# EasyEDA Pro project ProPrj_GraEsp(2)_2026-05-25.epro

# Schematic Schematic1
Board Name: Board1; Create Date: 2026-05-18; Page Name: P1; Project Name: GraEsp; Schematic Name: Schematic1; Update Date: 2026-05-18; Company: 嘉立创EDA; Page Size: A4; Version: V1.0
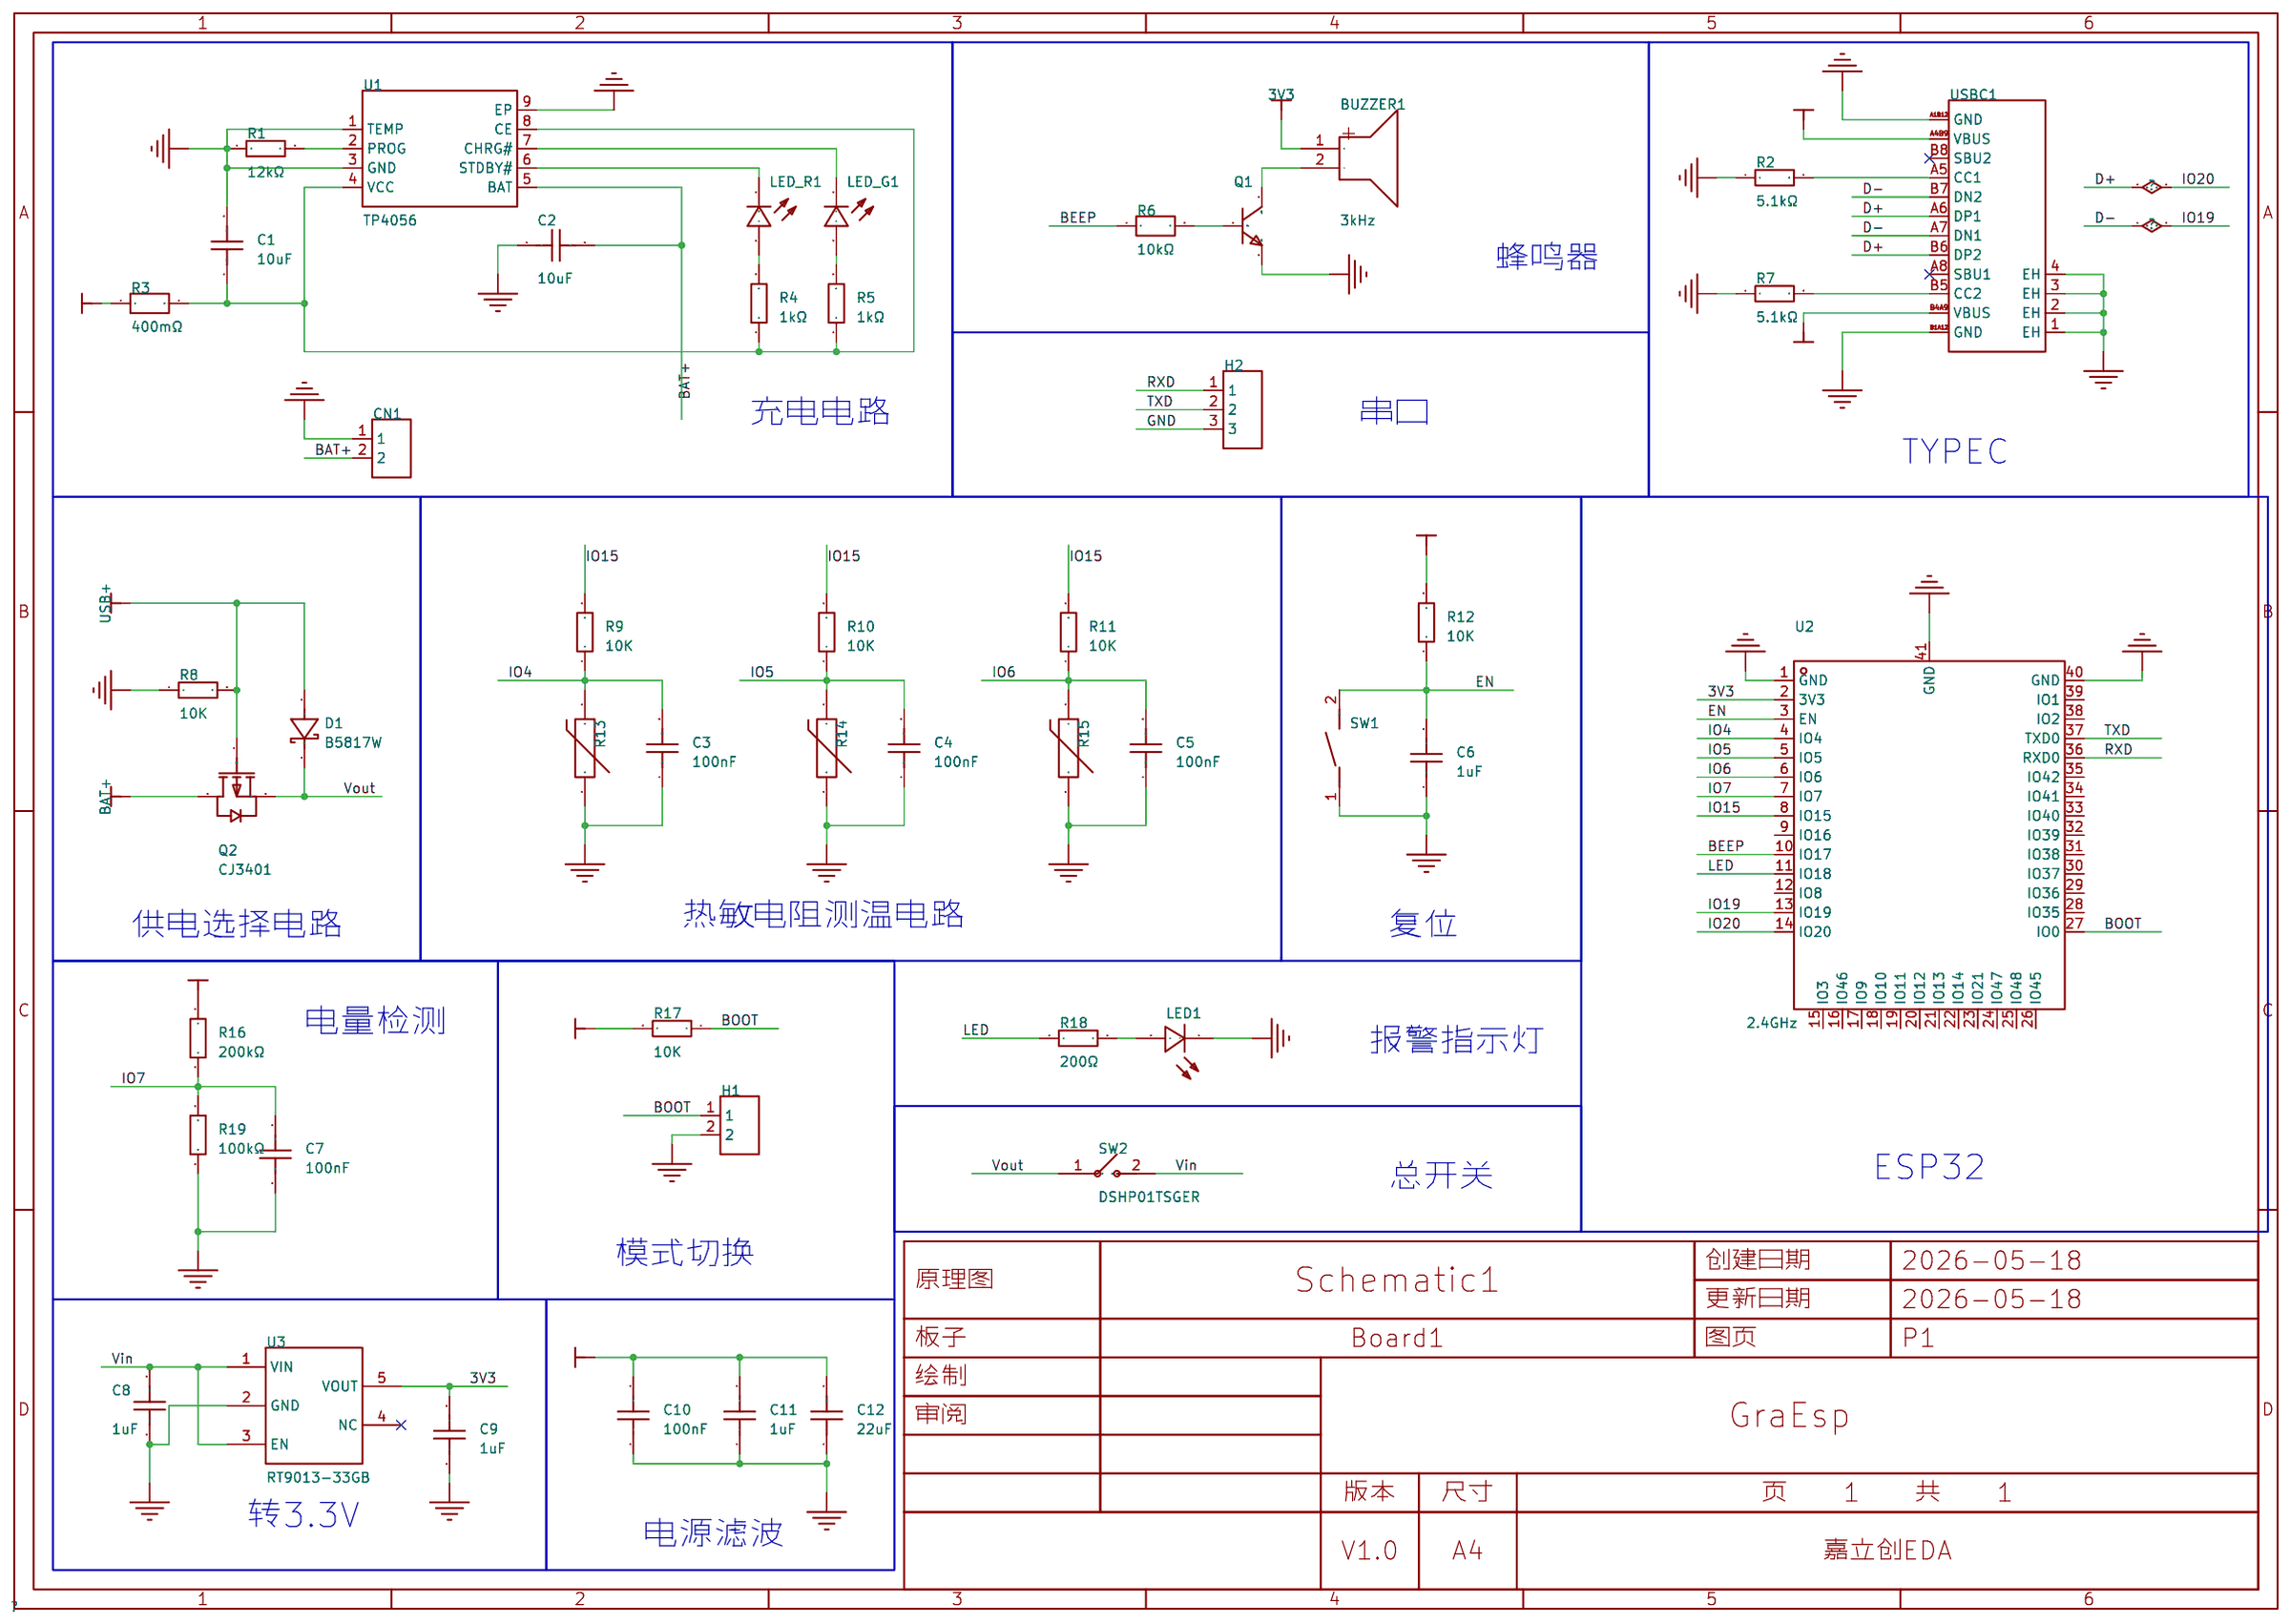
[diagram p0: schematic sheet]

## Parts
BUZZER1  3kHz  [BUZ-TH_BD9.0-P5.00-D0.6-FD]
C1  10uF  [C0603]
C2  10uF  [C0603]
C3  100nF  [C0603]
C4  100nF  [C0603]
C5  100nF  [C0603]
C6  1uF  [C0603]
C7  100nF  [C0603]
C8  1uF  [C0603]
C9  1uF  [C0603]
C10  100nF  [C0603]
C11  1uF  [C0603]
C12  22uF  [C0603]
CN1  ZX-XH2.54-2PZZ  [CONN-TH_2P-P2.50_HX25003-2A]
D1  B5817W  [SOD-123_L2.7-W1.6-LS3.7-FD]
H1  PZ254V-11-02P  [HDR-TH_2P-P2.54-V-M]
H2  PZ254V-11-03P  [HDR-TH_3P-P2.54-V-M_PZ254V-11-03P]
LED1  LTST-C190YKT  [LED0603-RD]
LED_G1  NCD0603G1  [LED0603-RD_1]
LED_R1  NCD0603R1  [LED0603-RD_RED]
Q1  MMBT3904 1AM  [SOT-23-3_L2.9-W1.3-P0.95-LS2.4-BR]
Q2  CJ3401  [SOT-23-3_L2.9-W1.6-P1.90-LS2.8-BR]
R1  12kΩ  [R0603]
R2  5.1kΩ  [R0603]
R3  400mΩ  [R0603]
R4  1kΩ  [R0603]
R5  1kΩ  [R0603]
R6  10kΩ  [R0603]
R7  5.1kΩ  [R0603]
R8  10K  [R0603]
R9  10K  [R0603]
R10  10K  [R0603]
R11  10K  [R0603]
R12  10K  [R0603]
R13  MF52A103F3435 (A1)  [RES-TH_L2.5-W2.5-P1.70-D0.3]
R14  MF52A103F3435 (A1)  [RES-TH_L2.5-W2.5-P1.70-D0.3]
R15  MF52A103F3435 (A1)  [RES-TH_L2.5-W2.5-P1.70-D0.3]
R16  200kΩ  [R0603]
R17  10K  [R0603]
R18  200Ω  [R0603]
R19  100kΩ  [R0603]
SW1  TS-1088-AR02016  [SW-SMD_L3.9-W3.0-P4.45]
SW2  DSHP01TSGER  [SW-SMD_DSHP01TSGER]
U1  TP4056  [ESOP-8_L4.9-W3.9-P1.27-LS6.0-BL-EP]
U2  2.4GHz  [WIRELM-SMD_ESP32-S3-WROOM-1]
U3  RT9013-33GB  [SOT-23-5_L3.0-W1.7-P0.95-LS2.8-BL]
USBC1  TYPE-C-31-M-12  [USB-C_SMD-TYPE-C-31-M-12_1]

## Library data of the parts
BUZZER1 = HNB09A03: 驱动方式:有源(内含驱动线路);构造类型:电磁式;频率:3kHz;声压(SPL):85dB;; LCSC Part Name: 电磁式有源一体蜂鸣器HNB09A03; Supplier Part: C96102; Manufacturer: 华能; Supplier Footprint: 插件,D=9mm; JLCPCB Part Class: 扩展库; Datasheet: https://atta.szlcsc.com/upload/public/pdf/source/20241128/61C4C8C3938BB25F7C38FBE94CCE8DCF.pdf; Supplier: LCSC; Driver Circuitry: 有源(内含驱动线路); Technology: 电磁式; Voltage - Supply: 1.5V~4.5V; Current Consumption: 30mA; Sound Pressure Level(SPL): 85dB; Diameter(φD): 9mm; Height: 5.5mm; Operating Temperature: -20℃~+70℃
C1 C2 = CGA0603X5R106K100JT: 容值:10uF;精度:±10%;额定电压:10V;温度系数:X5R;; LCSC Part Name: 10uF ±10% 10V; Supplier Part: C6119842; Manufacturer: HRE(芯声); Supplier Footprint: 0603; JLCPCB Part Class: Extended Part; Supplier: LCSC; Tolerance: ±10%; Voltage Rating: 10V; Temperature Coefficient: X5R
C3-C5 C7 C10 = CGA0603X7R104K500JT: 容值:100nF;精度:±10%;额定电压:50V;温度系数:X7R;; LCSC Part Name: 100nF ±10% 50V; Supplier Part: C6119867; Manufacturer: HRE(芯声); Supplier Footprint: 0603; JLCPCB Part Class: Extended Part; Datasheet: https://atta.szlcsc.com/upload/public/pdf/source/20250103/C44077DA9E7B3EFAE02F22B6D3D1CBC9.pdf; Supplier: LCSC; Tolerance: ±10%; Voltage Rating: 50V; Temperature Coefficient: X7R
C6 C8 C9 = CGA0603X5R105K500JT: 容值:1uF;精度:±10%;额定电压:50V;温度系数:X5R;; LCSC Part Name: 1uF ±10% 50V; Supplier Part: C6119852; Manufacturer: HRE(芯声); Supplier Footprint: 0603; JLCPCB Part Class: 扩展库; Supplier: LCSC; Tolerance: ±10%; Voltage Rating: 50V; Temperature Coefficient: X5R
C11 = CGA0603X5R105K500JT: 容值:1uF;精度:±10%;额定电压:50V;温度系数:X5R;; LCSC Part Name: 1uF ±10% 50V; Supplier Part: C6119852; Manufacturer: HRE(芯声); Supplier Footprint: 0603; JLCPCB Part Class: 扩展库; Datasheet: https://item.szlcsc.com/datasheet/CGA0603X5R105K500JT/7062558.html; Supplier: LCSC; Tolerance: ±10%; Voltage Rating: 50V; Temperature Coefficient: X5R
C12 = CGA0603X5R226M160JT: 容值:22uF;精度:±20%;额定电压:16V;温度系数:X5R;; LCSC Part Name: 22uF ±20% 16V; Supplier Part: C6119868; Manufacturer: HRE(芯声); Supplier Footprint: 0603; JLCPCB Part Class: 扩展库; Datasheet: https://item.szlcsc.com/datasheet/CGA0603X5R226M160JT/7062574.html; Supplier: LCSC; Tolerance: ±20%; Voltage Rating: 16V; Temperature Coefficient: X5R
CN1 = ZX-XH2.54-2PZZ: 插针结构:1x2P;间距:2.5mm;安装方式:直插;参考系列:XH;总PIN数:2P;排数:1;每排PIN数:2;行距:-;额定电流:3A;触头材质:黄铜;触头镀层:锡;工作温度范围:-25℃~+85℃;; LCSC Part Name: 1x2P 间距:2.5mm 直插 系列:XH; Supplier Part: C7429632; Manufacturer: Megastar(兆星); Supplier Footprint: 插件,P=2.5mm; JLCPCB Part Class: Extended Part; Datasheet: https://atta.szlcsc.com/upload/public/pdf/source/20230619/19BA6947230AA44A04D3EDD65E618FD0.pdf; Supplier: LCSC; Pins Structure: 1x2P; Pitch: 2.5mm; Mounting Type: 直插; Reference Series: XH; Number of Pins: 2P; Number of Rows: 1; Number of PINs Per Row: 2; Rated Current: 3A; Contact Material: 黄铜; Contact Plating: 锡; Operating Temperature: -25℃~+85℃; Rated Voltage (Max): 250V; Plastic Material: PA66; Flame Retardant Rating: UL94V-0; Color: 白色; Z-Height of the Board: 7mm; X-Length of Bottom Edge on Board (Spacing Line): 7.5mm; Y-Width of Bottom Edge on Board: 5.9mm
D1 = B5817W_C7420328: 二极管配置:独立式;正向压降(Vf):450mV@1.0A;直流反向耐压(Vr):20V;整流电流:1A;; LCSC Part Name: 电压:20V 电流:1A; Supplier Part: C7420328; Manufacturer: 宏迦橙; Supplier Footprint: SOD-123; JLCPCB Part Class: 扩展库; Datasheet: https://atta.szlcsc.com/upload/public/pdf/source/20230828/EE0D571642CD3E42C48F1182066654A1.pdf; Supplier: LCSC; Diode Configuration: 独立式; Forward Voltage (Vf@If): 450mV@1.0A; Reverse Voltage (Vr): 20V; Rectified Current: 1A; Reverse Leakage Current (Ir): 1mA@20V
H1 = PZ254V-11-02P: 插针结构:1x2P;间距:2.54mm;行距:-;圆针/方针:方针;安装方式:直插;排数:单排;总PIN位数:2P;额定电流:3A;额定电压:250V;配合针长度:6mm;塑高:2.5mm;端接针长度:3mm;触头材质:黄铜;触头镀层:-;工作温度:-40℃~+105℃;颜色:黑色;; LCSC Part Name: 1x2P 间距:2.54mm 方针 直插; Supplier Part: C492401; Manufacturer: XFCN(兴飞); Supplier Footprint: 插件,P=2.54mm; JLCPCB Part Class: Extended Part; Datasheet: https://item.szlcsc.com/datasheet/PZ254V-11-02P/502957.html; Supplier: LCSC; Pin Structure: 1x2P; Pitch: 2.54mm; Circluar Pins/Square Pins: 方针; Mounting Type: 直插; Number of Rows: 单排; Number of Pins: 2P; Current Rating: 3A; Voltage Rating (Max): 250V; Length of Mating Pin: 6mm; Insulation Height: 2.5mm; Length of End Connection Pin: 3mm; Contact Material: 黄铜; Operating Temperature: -40℃~+105℃; Color: 黑色
H2 = PZ254V-11-03P: 插针结构:1x3P;间距:2.54mm;行距:-;圆针/方针:方针;安装方式:直插;排数:单排;总PIN位数:3P;额定电流:3A;额定电压:250V;配合针长度:6mm;塑高:2.5mm;端接针长度:3mm;工作温度:-40℃~+105℃;颜色:黑色;; LCSC Part Name: 1x3P 间距:2.54mm 方针 直插; Supplier Part: C2937625; Manufacturer: XFCN(兴飞); Supplier Footprint: 插件,P=2.54mm; JLCPCB Part Class: Extended Part; Datasheet: https://item.szlcsc.com/datasheet/PZ254V-11-03P/3293280.html; Supplier: LCSC; Pin Structure: 1x3P; Pitch: 2.54mm; Circluar Pins/Square Pins: 方针; Mounting Type: 直插; Number of Rows: 单排; Number of Pins: 3P; Current Rating: 3A; Voltage Rating (Max): 250V; Length of Mating Pin: 6mm; Insulation Height: 2.5mm; Length of End Connection Pin: 3mm; Operating Temperature: -40℃~+105℃; Color: 黑色
LED1 = LTST-C190YKT: 发光颜色:黄色;正向电压(VF):2.1V;功率:60mW;正向电流:20mA;主波长:588nm;二极管配置:-;透镜颜色:无色透明透镜;色温:-;发光强度:6mcd;发光角度:130°;载带方式:-;工作温度:-55℃~+85℃;; LCSC Part Name: 黄灯; Supplier Part: C125097; Manufacturer: LITEON(光宝); Supplier Footprint: 0603; JLCPCB Part Class: 扩展库; Datasheet: https://atta.szlcsc.com/upload/public/pdf/source/20180326/C125097_8A610ECE31461EDC7D081EA09A856E73.pdf; Supplier: LCSC; Emitted Color: 黄色; Forward Voltage (VF): 2.1V; Power Dissipation: 60mW; Forward Current: 20mA; Dominant Wavelength: 588nm; Peak Wavelength: 585nm; Lens Color: 无色透明透镜; Luminous Intensity: 6mcd; Viewing Angle: 130°; Operating Temperature: -55℃~+85℃
LED_G1 = NCD0603G1: 发光颜色:翠绿色;正向压降(Vf):2.6V~3.6V;功率:72mW;正向电流:20mA;波长:515nm~530nm;透镜颜色:-;发光强度:330mcd~900mcd;发光角度:130°;工作温度:-30℃~+85℃;; Supplier Part: C84267; Manufacturer: 国星光电; Supplier Footprint: 0603; JLCPCB Part Class: Extended Part; Datasheet: https://atta.szlcsc.com/upload/public/pdf/source/20200820/C84267_04BA7703640BAC111D09F5EFB971FBF3.pdf; Supplier: LCSC; Illumination Color: 翠绿色; Voltage - Forward(Vf): 2.6V~3.6V; Power(Watts): 72mW; Forward Current: 20mA; Wavelength - Dominant: 515nm~530nm; Luminous Intensity: 330mcd~900mcd; Viewing Angle: 130°; Operating Temperature: -30℃~+85℃
LED_R1 = NCD0603R1_C84263: 灯头类型:-;发光颜色:红色;正向压降(Vf):1.6V~2.6V;功率:65mW;正向电流:25mA;波长:615nm~630nm;二极管配置:独立二极管;透镜颜色:-;色温:-;发光强度:80mcd~220mcd;发光角度:130°;载带方式:-;工作温度:-30℃~+85℃;; Supplier Part: C84263; Manufacturer: 国星光电; Supplier Footprint: 0603; JLCPCB Part Class: Extended Part; Datasheet: https://atta.szlcsc.com/upload/public/pdf/source/20200820/C84263_DABC6A75E58F576973B407FDBA283D60.pdf; Supplier: LCSC; Illumination Color: 红色; Voltage - Forward(Vf): 1.6V~2.6V; Power(Watts): 65mW; Forward Current: 25mA; Wavelength - Dominant: 615nm~630nm; Diode Configuration: 独立二极管; Luminous Intensity: 80mcd~220mcd; Viewing Angle: 130°; Operating Temperature: -30℃~+85℃
Q1 = MMBT3904 1AM: 晶体管类型:NPN;集电极电流(Ic):200mA;集射极击穿电压(Vceo):40V;耗散功率(Pd):200mW;直流电流增益(hFE):300@10mA,1V;; Supplier Part: C2985655; Manufacturer: YONGYUTAI(永裕泰); Supplier Footprint: SOT-23; JLCPCB Part Class: 扩展库; Datasheet: https://atta.szlcsc.com/upload/public/pdf/source/20220328/E5F75A35095E467F40664A08ADD2DE31.pdf; Supplier: LCSC; type: NPN; Current - Collector(Ic): 200mA; Collector - Emitter Voltage VCEO: 40V; Pd - Power Dissipation: 200mW; DC Current Gain: 300@10mA,1V; Transition frequency(fT): 300MHz; Current - Collector Cutoff: 100nA; Vce Saturation(VCE(sat)): 300mV
Q2 = CJ3401: 类型:1个P沟道;漏源电压(Vdss):30V;连续漏极电流(Id):4.2A;导通电阻(RDS(on)):75mΩ@4.5V,4A;耗散功率(Pd):350mW;阈值电压(Vgs(th)):1.3V;; LCSC Part Name: 1个P沟道 耐压:30V 电流:4.2A; Supplier Part: C13799; Manufacturer: CJ(江苏长电/长晶); Supplier Footprint: SOT-23; JLCPCB Part Class: 扩展库; Datasheet: https://atta.szlcsc.com/upload/public/pdf/source/20140815/1457707217656.pdf; Supplier: LCSC; Type: 1个P沟道; Drain to Source Voltage: 30V; Current - Continuous Drain(Id): 4.2A; RDS(on): 75mΩ@4.5V,4A; Pd - Power Dissipation: 350mW; Gate Threshold Voltage (Vgs(th)@Id): 1.3V; Input Capacitance(Ciss@Vds): 954pF; Reverse Transfer Capacitance (Crss@Vds): 77pF; Operating Temperature: -55℃~+150℃
R1 = 0603WAF1202T5E: 电阻类型:厚膜电阻;阻值:12kΩ;精度:±1%;功率:100mW;最大工作电压:75V;温度系数:±100ppm/℃;; LCSC Part Name: 12kΩ ±1% 100mW 厚膜电阻; Supplier Part: C22790; Manufacturer: UNI-ROYAL(厚声); Supplier Footprint: 0603; JLCPCB Part Class: Basic Part; Datasheet: https://atta.szlcsc.com/upload/public/pdf/source/20200306/C422600_1E6D84923E4A46A82E41ADD87F860B5C.pdf; Supplier: LCSC; Type: 厚膜电阻; Tolerance: ±1%; Power(Watts): 100mW; Overload Voltage (Max): 75V; Temperature Coefficient: ±100ppm/℃; Operating Temperature Range: -55℃~+155℃
R2 R7 = 0603WAF5101T5E: 电阻类型:厚膜电阻;阻值:5.1kΩ;精度:±1%;功率:100mW;最大工作电压:75V;温度系数:±100ppm/℃;; LCSC Part Name: 5.1kΩ ±1% 100mW 厚膜电阻; Supplier Part: C23186; Manufacturer: UNI-ROYAL(厚声); Supplier Footprint: 0603; JLCPCB Part Class: Basic Part; Datasheet: https://atta.szlcsc.com/upload/public/pdf/source/20200306/C422600_1E6D84923E4A46A82E41ADD87F860B5C.pdf; Supplier: LCSC; Type: 厚膜电阻; Tolerance: ±1%; Power(Watts): 100mW; Overload Voltage (Max): 75V; Temperature Coefficient: ±100ppm/℃; Operating Temperature Range: -55℃~+155℃
R3 = FRL0603FR400TS: 电阻类型:厚膜电阻;阻值:400mΩ;精度:±1%;功率:100mW;工作电压:100V;温度系数:±300ppm/℃;; LCSC Part Name: 400mΩ ±1% 100mW 厚膜电阻; Supplier Part: C5126047; Manufacturer: FOJAN(富捷); Supplier Footprint: 0603; JLCPCB Part Class: Extended Part; Supplier: LCSC; Type: 厚膜电阻; Tolerance: ±1%; Power(Watts): 100mW; Voltage-Supply(Max): 100V; Temperature Coefficient: ±300ppm/℃; Operating Temperature: -55℃~+155℃
R4 R5 = 0603WAF1001T5E: 电阻类型:厚膜电阻;阻值:1kΩ;精度:±1%;功率:100mW;最大工作电压:75V;温度系数:±100ppm/℃;; LCSC Part Name: 1kΩ ±1% 100mW 厚膜电阻; Supplier Part: C21190; Manufacturer: UNI-ROYAL(厚声); Supplier Footprint: 0603; JLCPCB Part Class: Basic Part; Datasheet: https://atta.szlcsc.com/upload/public/pdf/source/20200306/C422600_1E6D84923E4A46A82E41ADD87F860B5C.pdf; Supplier: LCSC; Type: 厚膜电阻; Tolerance: ±1%; Power(Watts): 100mW; Overload Voltage (Max): 75V; Temperature Coefficient: ±100ppm/℃; Operating Temperature Range: -55℃~+155℃
R6 = SC0603J1002F2BNRH: 阻值:10kΩ;精度:±5%;功率:-;温度系数:±100ppm/℃;; LCSC Part Name: 10kΩ ±5%; Supplier Part: C3152154; Manufacturer: Sunway(信维通信); Supplier Footprint: 0603; JLCPCB Part Class: 扩展库; Datasheet: https://atta.szlcsc.com/upload/public/pdf/source/20220728/FFCE43BB6DF8FA16AEE331F0F4B289DE.pdf; Supplier: LCSC; Tolerance: ±5%; Temperature Coefficient: ±100ppm/℃
R8-R12 R17 = Res_0603: Supplier Footprint: 0603
R13-R15 = MF52A103F3435 (A1): 阻值(25℃):10kΩ;B值(25℃/50℃):-;电阻精度:±1%;功率:50mW;B值精度:±1%;最大稳态电流(25℃):-;; LCSC Part Name: 10kΩ 电阻精度:±1%; Supplier Part: C84036; Manufacturer: 时恒; Supplier Footprint: 插件,P=1.7mm; JLCPCB Part Class: Extended Part; Datasheet: https://atta.szlcsc.com/upload/public/pdf/source/20161024/1477288590593.pdf; Supplier: LCSC; Resistance @ 25℃: 10kΩ; Resistance Tolerance: ±1%; B Constant (25℃/85℃): 3435K; Power: 50mW; B Constant Tolerance: ±1%; Operating Temperature: -55℃~+125℃
R16 = 0603WAF2003T5E: 电阻类型:厚膜电阻;阻值:200kΩ;精度:±1%;功率:100mW;最大工作电压:75V;温度系数:±100ppm/℃;; LCSC Part Name: 200kΩ ±1% 100mW 厚膜电阻; Supplier Part: C25811; Manufacturer: UNI-ROYAL(厚声); Supplier Footprint: 0603; JLCPCB Part Class: Basic Part; Datasheet: https://atta.szlcsc.com/upload/public/pdf/source/20200306/C422600_1E6D84923E4A46A82E41ADD87F860B5C.pdf; Supplier: LCSC; Type: 厚膜电阻; Tolerance: ±1%; Power(Watts): 100mW; Overload Voltage (Max): 75V; Temperature Coefficient: ±100ppm/℃; Operating Temperature Range: -55℃~+155℃
R18 = AECR0603F200RK9: 电阻类型:厚膜电阻;阻值:200Ω;精度:±1%;功率:100mW;工作电压:50V;温度系数:±100ppm/℃;; LCSC Part Name: 厚膜电阻 200Ω ±1% 100mW; Supplier Part: C328346; Manufacturer: RESI(开步睿思); Supplier Footprint: 0603; JLCPCB Part Class: 扩展库; Datasheet: https://atta.szlcsc.com/upload/public/pdf/source/20181212/C352486_55819DC58ECB15BFA3B0F11121E3606D.pdf; Supplier: LCSC; Type: 厚膜电阻; Tolerance: ±1%; Power(Watts): 100mW; Voltage-Supply(Max): 50V; Temperature Coefficient: ±100ppm/℃; Operating Temperature: -55℃~+155℃
R19 = 0603WAF1003T5E: 电阻类型:厚膜电阻;阻值:100kΩ;精度:±1%;功率:100mW;工作电压:75V;温度系数:±100ppm/℃;; LCSC Part Name: 100kΩ ±1% 100mW 厚膜电阻; Supplier Part: C25803; Manufacturer: UNI-ROYAL(厚声); Supplier Footprint: 0603; JLCPCB Part Class: Basic Part; Datasheet: https://item.szlcsc.com/datasheet/0603WAF1003T5E/26546.html; Supplier: LCSC; Type: 厚膜电阻; Tolerance: ±1%; Power(Watts): 100mW; Voltage-Supply(Max): 75V; Temperature Coefficient: ±100ppm/℃; Operating Temperature: -55℃~+155℃
SW1 = TS-1088-AR02016: 电路结构:单刀单掷;按钮形状:圆形按钮;作用力:1.6N;安装方式:立贴;开关长度:4mm;开关宽度:3mm;开关高度:2mm;带支架:不带支架;触点电流:50mA;额定电压:12V;工作寿命:10万次;; LCSC Part Name: 4*3*2mm 立贴 轻触开关; Supplier Part: C720477; Manufacturer: XUNPU(讯普); Supplier Footprint: SMD,4x3mm; JLCPCB Part Class: Basic Part; Datasheet: https://item.szlcsc.com/datasheet/TS-1088-AR02016/763484.html; Supplier: LCSC; Circuit: 单刀单掷; Actuator Style: 圆形按钮; Operating Force: 1.6N; Mounting Type: 立贴; Length: 4mm; Width: 3mm; Switch Height: 2mm; with Bracket: 不带支架; Contact Current: 50mA; Voltage Rating: 12V; Actuator/Cap Color: 黑色; Termination Style: SMD接片; Life: 10万次; Operating Temperature: -30℃~+80℃
SW2 = DSHP01TSGER: 电路结构:单刀单掷;开关位数:1位;额定电流:25mA;额定电压:24V;工作寿命:3千次;颜色:黑色;; LCSC Part Name: 1位单PIN 1.27mm间距贴片型 KE拨码开关 编码开关; Supplier Part: C3293141; Manufacturer: 康深; Supplier Footprint: SMD; JLCPCB Part Class: Extended Part; Datasheet: https://item.szlcsc.com/datasheet/DSHP01TSGER/3856576.html; Supplier: LCSC; Circuit: 单刀单掷; Number of Positions: 1位; Current Rating: 25mA; Voltage Rating: 24V; Operating Temperature: -30℃~+85℃; Operating Life: 3千次; Color: 黑色
U1 = TP4056_C725790: Supplier Part: C725790; Manufacturer: UMW(友台半导体); Supplier Footprint: ESOP-8; JLCPCB Part Class: Extended Part; Datasheet: https://atta.szlcsc.com/upload/public/pdf/source/20231109/CF74897CE79A500F7FE27A45ADCCC631.pdf; Supplier: LCSC
U2 = ESP32-S3-WROOM-1-N8R8: 核心芯片:ESP32-S3R8;频率:2.4GHz;天线形式:板载PCB天线;发射功率:20.5dBm;接收灵敏度:-104.5dBm;; LCSC Part Name: 不带固件 2.4GHz Wi-Fi (802.11b/g/n) + 蓝牙 5 (LE) 模组; Supplier Part: C2913201; Manufacturer: ESPRESSIF(乐鑫); Supplier Footprint: SMD,25.5x18mm; JLCPCB Part Class: 扩展库; Datasheet: https://item.szlcsc.com/datasheet/ESP32-S3-WROOM-1-N8R8/3198299.html; Supplier: LCSC; Utilized IC / Part: ESP32-S3R8; Wireless Standard: Bluetooth5.0; Interface Type: I2C；GPIO；UART；SPI；USB；I2S; Antenna Type: 板载PCB天线; Output Power: 20.5dBm; Voltage - Supply: 3V~3.6V; Receive  Current: 97mA; Send  Current: 330mA; Sensitivity: -104.5dBm; Operating Temperature: -40℃~+65℃
U3 = RT9013-33GB: 输出类型:固定;最大输入电压:5.5V;输出电压:3.3V;输出电流:500mA;电源纹波抑制比(PSRR):50dB@(10kHz);输出极性:正极;; LCSC Part Name: 输入5.5V 输出3.3V 500mA; Supplier Part: C47773; Manufacturer: RICHTEK(立锜); Supplier Footprint: SOT-23-5; JLCPCB Part Class: 扩展库; Datasheet: https://atta.szlcsc.com/upload/public/pdf/source/20150504/1457707282459.pdf; Supplier: LCSC; Output Type: 固定; Maximum Input Voltage: 5.5V; Output Voltage: 3.3V; Output Current: 500mA; Power Supply Rejection Ratio (PSRR): 50dB@(10kHz); Dropout Voltage: 400mV@(500mA); standby current: 50uA; Feature: 低ESR；防静电保护；热保护(TSD)；过流保护(OCP)；带使能; Operating Temperature: -40℃~+85℃; Output Polarity: 正极; Number of Outputs: 1
USBC1 = TYPE-C-31-M-12: 连接器类型:Type-C;协议标准:-;公母:母;安装方式:卧贴;触点数量:16P;端口数量:1;额定电流 - 电源:5A;工作温度:-30℃~+80℃;; LCSC Part Name: Type-C 母 卧贴; Supplier Part: C165948; Manufacturer: 韩国韩荣; Supplier Footprint: SMD; JLCPCB Part Class: 扩展库; Datasheet: https://item.szlcsc.com/datasheet/TYPE-C-31-M-12/177331.html; Supplier: LCSC; Connector Type: Type-C; Gender: 母; Mounting Type: 卧贴; Number of Contacts: 16P; Number of Ports: 1; Current Rating-Power: 5A; Voltage Rating: 20V; Connect-Disconnect Life: 1万次; Length: 7.35mm; Operating Temperature: -30℃~+80℃

## Nets
3V3: BUZZER1.1(+) C9.2 C10.2 C11.2 C12.2 R12.2 R17.2 U2.2(3V3) U3.5(VOUT)
GND: C1.2 C2.2 C3.1 C4.1 C5.1 C6.1 C7.1 C8.1 C9.1 C10.1 C11.1 C12.1 CN1.1 H1.2 H2.3 LED1.1(-) Q1.2(EMITTER) R1.1 R2.1 R7.1 R8.1 R13.2 R14.2 R15.2 R19.2 SW1.1 U1.1(TEMP) U1.3(GND) U1.9(EP) U2.1(GND) U2.40(GND) U2.41(GND) U3.2(GND) USBC1.1(EH) USBC1.2(EH) USBC1.3(EH) USBC1.4(EH) USBC1.A1B12(GND) USBC1.B1A12(GND)
Vin: C8.2 SW2.2 U3.1(VIN) U3.3(EN)
BAT+: C2.1 CN1.2 Q2.3(D) R16.1 U1.5(BAT)
BEEP: R6.1 U2.10(IO17)
BOOT: H1.1 R17.1 U2.27(IO0)
D+: U2.14(IO20) USBC1.A6(DP1) USBC1.B6(DP2)
D-: U2.13(IO19) USBC1.A7(DN1) USBC1.B7(DN2)
EN: C6.2 R12.1 SW1.2 U2.3(EN)
IO4: C3.2 R9.1 R13.1 U2.4(IO4)
IO5: C4.2 R10.1 R14.1 U2.5(IO5)
IO6: C5.2 R11.1 R15.1 U2.6(IO6)
IO7: C7.2 R16.2 R19.1 U2.7(IO7)
IO15: R9.2 R10.2 R11.2 U2.8(IO15)
LED: R18.1 U2.11(IO18)
RXD: H2.1 U2.36(RXD0)
TXD: H2.2 U2.37(TXD0)
USB+: D1.1(A) Q2.1(G) R3.1 R8.2 USBC1.A4B9(VBUS) USBC1.B4A9(VBUS)
Vout: D1.2(K) Q2.2(S) SW2.1
$1N1210: R1.2 U1.2(PROG)
$1N1215: C1.1 R3.2 R4.1 R5.1 U1.4(VCC) U1.8(CE)
$1N1216: LED_R1.1(K) U1.6(STDBY#)
$1N1217: LED_G1.1(K) U1.7(CHRG#)
$1N1218: LED_R1.2(A) R4.2
$1N1219: LED_G1.2(A) R5.2
$1N3085: R7.2 USBC1.B5(CC2)
$1N3089: R2.2 USBC1.A5(CC1)
$1N3711: LED1.2(+) R18.2
$1N3715: BUZZER1.2(-) Q1.3(COLLECTOR)
$1N3716: Q1.1(BASE) R6.2

Not connected (* = marked no-connect by the designer): U2 9(IO16) 12(IO8) 15(IO3) 16(IO46) 17(IO9) 18(IO10) 19(IO11) 20(IO12) 21(IO13) 22(IO14) 23(IO21) 24(IO47) 25(IO48) 26(IO45) 28(IO35) 29(IO36) 30(IO37) 31(IO38) 32(IO39) 33(IO40) 34(IO41) 35(IO42) 38(IO2) 39(IO1); U3 4(NC)*; USBC1 A8(SBU1)* B8(SBU2)*

## Notes on the sheet
- 蜂鸣器
- 充电电路
- 串口
- TYPEC
- 热敏电阻测温电路
- 供电选择电路
- 复位
- 电量检测
- 报警指示灯
- ESP32
- 总开关
- 模式切换
- 转3.3V
- 电源滤波

# Board PCB1
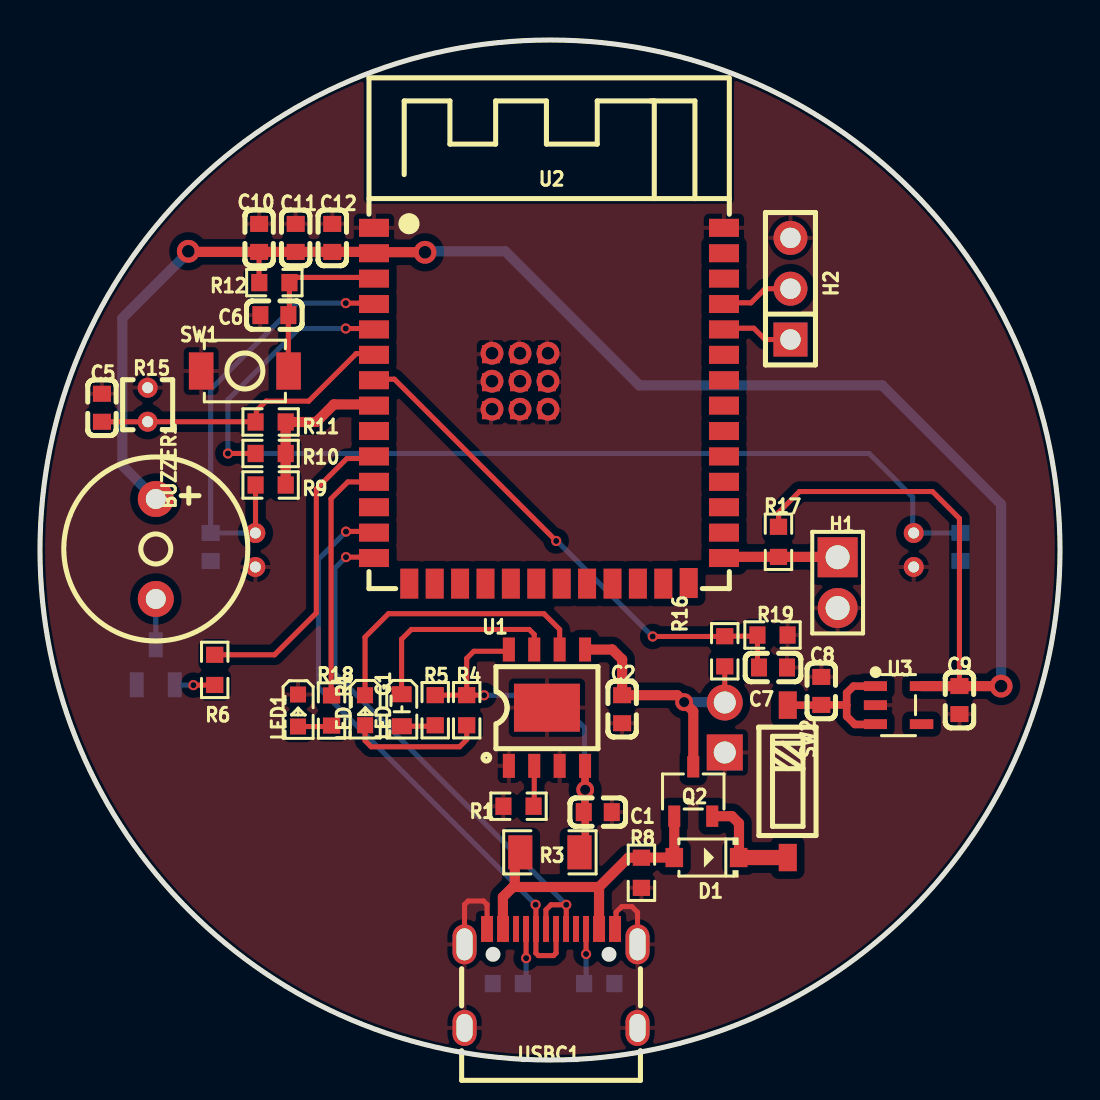
[diagram p1: board, top side]
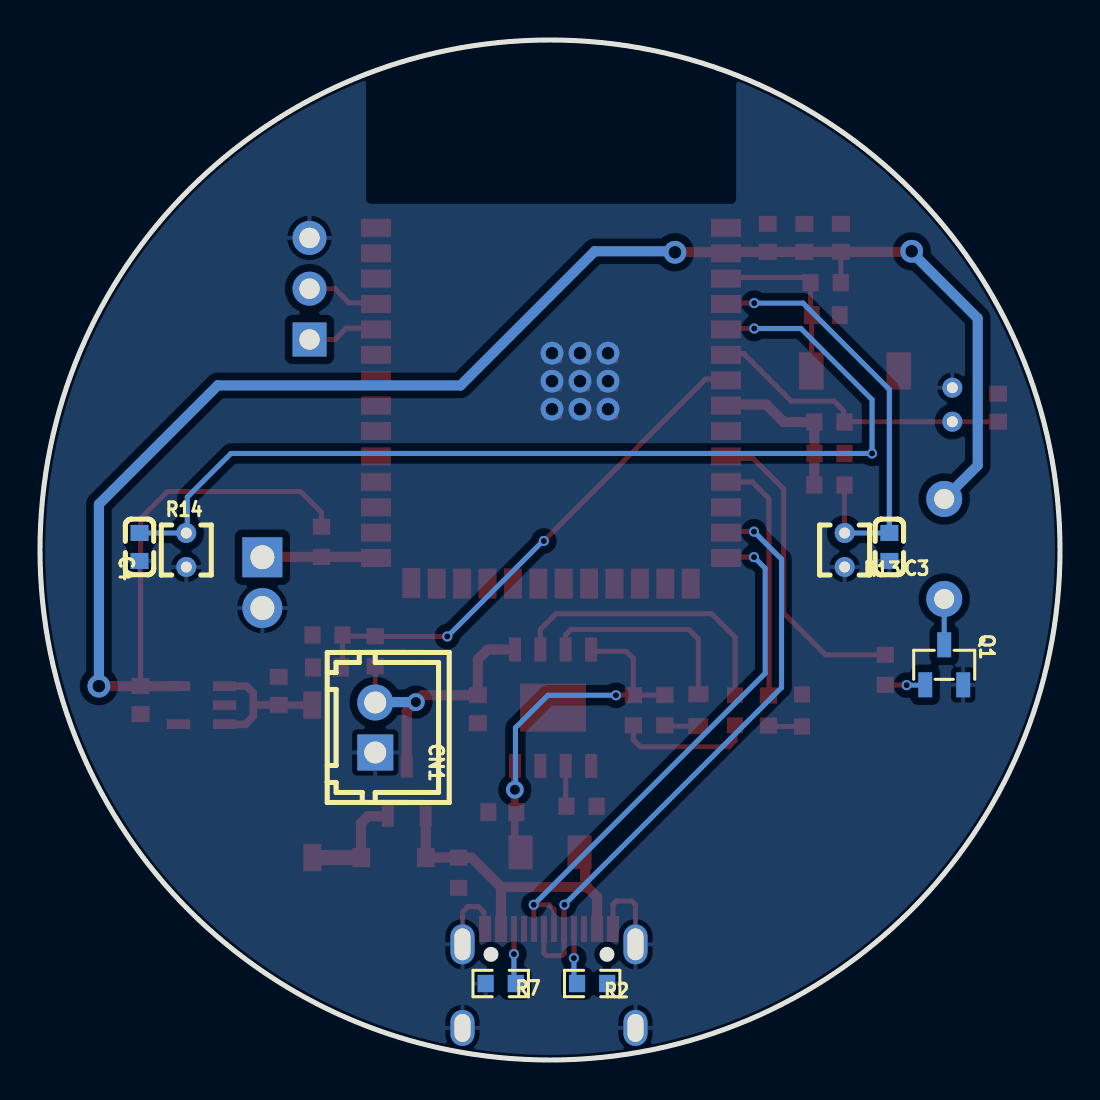
[diagram p2: board, bottom side, seen from below]

Outline 51 x 51 mm; copper layers: Top Layer, Bottom Layer. Coordinates in mm from the lower left corner of the outline.
Outline path: circle c25.5,25.5 r25.5
Stack: Top Layer 0.035mm / Dielectric1 1.51mm FR4 er 4.5 / Bottom Layer 0.035mm

## Design rules (mm)
spacing copperThickness1oz (default): track to track 0.102, other pairs 0.152 to 0.3
spacing copperThickness2oz: track to track 0.203, other pairs 0.152 to 0.3
track width copperThickness1oz (default): min 0.127, default 0.254, max 2.54
track width copperThickness2oz: min 0.203, default 0.254, max 2.54
differential pair differentialPair (default): width min 0.127, default 0.254, max 2.54; gap min 0.152, default 0.152
net VOUT uses copperRegion
net GND uses copperRegion

## Placement (name value [footprint] x y rotation side)
BUZZER1  3kHz  [BUZ-TH_BD9.0-P5.00-D0.6-FD]  5.79 25.55 270 top
C1  10uF  [C0603]  27.89 12.39 0 top
C2  10uF  [C0603]  29.11 17.54 270 top
C3  100nF  [C0603]  8.53 25.65 90 bottom
C4  100nF  [C0603]  46.02 25.65 90 bottom
C5  100nF  [C0603]  3.1 32.61 270 top
C6  1uF  [C0603]  11.72 37.24 0 top
C7  100nF  [C0603]  36.65 19.62 180 top
C8  1uF  [C0603]  39.06 18.45 270 top
C9  1uF  [C0603]  45.97 18 90 top
C10  100nF  [C0603]  10.96 41.1 270 top
C11  1uF  [C0603]  12.78 41.1 270 top
C12  22uF  [C0603]  14.61 41.1 270 top
CN1  ZX-XH2.54-2PZZ  [CONN-TH_2P-P2.50_HX25003-2A]  34.24 16.63 90 bottom
D1  B5817W  [SOD-123_L2.7-W1.6-LS3.7-FD]  33.32 10.12 0 top
H1  PZ254V-11-02P  [HDR-TH_2P-P2.54-V-M]  39.88 23.87 270 top
H2  PZ254V-11-03P  [HDR-TH_3P-P2.54-V-M_PZ254V-11-03P]  37.52 38.56 90 top
LED1  LTST-C190YKT  [LED0603-RD]  12.9 17.47 270 top
LED_G1  NCD0603G1  [LED0603-RD_1]  18.08 17.49 270 top
LED_R1  NCD0603R1  [LED0603-RD_RED]  16.25 17.49 270 top
Q1  MMBT3904 1AM  [SOT-23-3_L2.9-W1.3-P0.95-LS2.4-BR]  5.79 19.76 270 bottom
Q2  CJ3401  [SOT-23-3_L2.9-W1.6-P1.90-LS2.8-BR]  32.66 13.42 270 top
R1  12kΩ  [R0603]  23.93 12.69 0 top
R2  5.1kΩ  [R0603]  23.39 3.82 0 bottom
R3  400mΩ  [R1206]  25.49 10.38 0 top
R4  1kΩ  [R0603]  21.33 17.49 270 top
R5  1kΩ  [R0603]  19.76 17.49 270 top
R6  10kΩ  [R0603]  8.74 19.51 270 top
R7  5.1kΩ  [R0603]  27.96 3.82 180 bottom
R8  10K  [R0603]  30.07 9.36 90 top
R9  10K  [R0603]  11.53 28.75 0 top
R10  10K  [R0603]  11.53 30.33 0 top
R11  10K  [R0603]  11.53 31.9 0 top
R12  10K  [R0603]  11.72 38.87 180 top
R13  MF52A103F3435 (A1)  [RES-TH_L2.5-W2.5-P1.70-D0.3]  10.77 25.5 270 bottom
R14  MF52A103F3435 (A1)  [RES-TH_L2.5-W2.5-P1.70-D0.3]  43.69 25.5 270 bottom
R15  MF52A103F3435 (A1)  [RES-TH_L2.5-W2.5-P1.70-D0.3]  5.38 32.76 90 top
R16  200kΩ  [R0603]  34.24 20.44 90 top
R17  10K  [R0603]  36.92 25.91 90 top
R18  200Ω  [R0603]  14.58 17.47 270 top
R19  100kΩ  [R0603]  36.63 21.25 0 top
SW1  TS-1088-AR02016  [SW-SMD_L3.9-W3.0-P4.45]  10.24 34.45 0 top
SW2  DSHP01TSGER  [SW-SMD_DSHP01TSGER]  37.39 13.93 180 top
U1  TP4056  [ESOP-8_L4.9-W3.9-P1.27-LS6.0-BL-EP]  25.35 17.62 0 top
U2  2.4GHz  [WIRELM-SMD_ESP32-S3-WROOM-1]  25.45 32.71 0 top
U3  RT9013-33GB  [SOT-23-5_L3.0-W1.7-P0.95-LS2.8-BL]  42.92 17.74 270 top
USBC1  TYPE-C-31-M-12  [USB-C_SMD-TYPE-C-31-M-12_1]  25.55 4.08 0 top

## Footprints (pads in the part's own frame, mm; a bottom-side part is the same pattern mirrored in y, then rotated)
BUZ-TH_BD9.0-P5.00-D0.6-FD
  round 1.8 hole 1: 1(-2.5,0) 2(2.5,0)
C0603
  rect 0.8x0.9 smd: 1(-0.7,0) 2(0.7,0)
CONN-TH_2P-P2.50_HX25003-2A
  rect 1.8x1.8 hole 1.1: 1(-1.25,0)
  round 1.8 hole 1.1: 2(1.25,0)
ESOP-8_L4.9-W3.9-P1.27-LS6.0-BL-EP
  rect 0.6x1.2 smd: 1(-1.905,-2.909) 2(-0.635,-2.909) 3(0.635,-2.909) 4(1.905,-2.909) 5(1.905,2.909) 6(0.635,2.909) 7(-0.635,2.909) 8(-1.905,2.909)
  rect 3.3x2.4 smd: 9(0,0)
HDR-TH_2P-P2.54-V-M
  rect 2x2 hole 1.2: 1(-1.27,0)
  round 2 hole 1.2: 2(1.27,0)
HDR-TH_3P-P2.54-V-M_PZ254V-11-03P
  rect 1.7x1.7 hole 1.02: 1(-2.54,0)
  round 1.7 hole 1.02: 2(0,0) 3(2.54,0)
LED0603-RD
  rect 0.8x0.8 smd: 1(-0.799,0) 2(0.799,0)
LED0603-RD_1
  rect 0.8x1 smd: 1(-0.799,-0.004) 2(0.799,0.004)
LED0603-RD_RED
  rect 0.8x0.8 smd: 1(-0.749,-0.004) 2(0.749,0.004)
R0603
  rect 0.806x0.864 smd: 1(-0.753,0) 2(0.753,0)
R1206
  rect 1.208x1.701 smd: 1(-1.479,0) 2(1.479,0)
RES-TH_L2.5-W2.5-P1.70-D0.3
  round 1 hole 0.55: 1(-0.85,0) 2(0.85,0)
SOD-123_L2.7-W1.6-LS3.7-FD
  rect 0.88x0.96 smd: 1(-1.61,0) 2(1.61,0)
SOT-23-3_L2.9-W1.3-P0.95-LS2.4-BR
  rect 1.25x0.7 smd: 1(1,-0.95) 2(1,0.95) 3(-1,0)
SOT-23-3_L2.9-W1.6-P1.90-LS2.8-BR
  rect 1.07x0.6 smd: 1(1.235,-0.95) 2(1.235,0.95) 3(-1.235,0)
SOT-23-5_L3.0-W1.7-P0.95-LS2.8-BL
  rect 0.49x1.157 smd: 1(-0.95,-1.153) 2(0,-1.153) 3(0.95,-1.153)
  rect 0.49x1.175 smd: 4(0.95,1.153) 5(-0.95,1.153)
SW-SMD_DSHP01TSGER
  rect 0.9x1.37 smd: 1(0,3.81) 2(0,-3.81)
SW-SMD_L3.9-W3.0-P4.45
  rect 1.23x1.86 smd: 1(-2.185,0) 2(2.185,0)
USB-C_SMD-TYPE-C-31-M-12_1
  oval 1.2x2 hole 0.8x1.6: 1(4.325,1.706) 4(-4.325,1.706)
  oval 1.2x1.8 hole 0.8x1.4: 2(4.325,-2.474) 3(-4.325,-2.474)
  custom 0.6x1.3 smd: A1B12(-3.2,2.474) A4B9(-2.4,2.474) B1A12(3.2,2.474) B4A9(2.401,2.474)
  rect 0.3x1.3 smd: A5(-1.25,2.474) A6(-0.25,2.474) A7(0.25,2.474) A8(1.25,2.474) B5(1.75,2.474) B6(0.75,2.474) B7(-0.75,2.474) B8(-1.75,2.474)
WIRELM-SMD_ESP32-S3-WROOM-1
  rect 1.5x0.9 smd: 1(-8.75,8.895) 2(-8.75,7.625) 3(-8.75,6.355) 4(-8.75,5.085) 5(-8.75,3.815) 6(-8.75,2.545) 7(-8.75,1.275) 8(-8.75,0.005) 9(-8.75,-1.265) 10(-8.75,-2.535) 11(-8.75,-3.805) 12(-8.75,-5.075) 13(-8.75,-6.345) 14(-8.75,-7.615) 27(8.75,-7.615) 28(8.75,-6.345) 29(8.75,-5.075) 30(8.75,-3.805) 31(8.75,-2.535) 32(8.75,-1.265) 33(8.75,0.005) 34(8.75,1.275) 35(8.75,2.545) 36(8.75,3.815) 37(8.75,5.085) 38(8.75,6.355) 39(8.75,7.625) 40(8.75,8.895)
  rect 0.9x1.5 smd: 15(-6.985,-8.895) 16(-5.715,-8.895) 17(-4.445,-8.895) 18(-3.175,-8.895) 19(-1.905,-8.895) 20(-0.635,-8.895) 21(0.635,-8.895) 22(1.905,-8.895) 23(3.175,-8.895) 24(4.445,-8.895) 25(5.715,-8.895) 26(6.985,-8.865)
  rect 0.9x0.9 smd: 41(-2.9,2.575) 41(-2.9,1.175) 41(-2.9,-0.225) 41(-1.5,2.575) 41(-1.5,1.175) 41(-1.5,-0.225) 41(-0.1,2.575) 41(-0.1,1.175) 41(-0.1,-0.225)

## Nets
As in the schematic.

Pads without a net: U2 9 12 15 16 17 18 19 20 21 22 23 24 25 26 28 29 30 31 32 33 34 35 38 39; U3 4; USBC1 A8 B8

## Via types
v1: diameter 1.143, hole 0.635, Top Layer to Bottom Layer, 12 vias
v2: diameter 0.508, hole 0.305, Top Layer to Bottom Layer, 13 vias
v3: diameter 0.889, hole 0.508, Top Layer to Bottom Layer, 2 vias

## Routing (per net, layer and track width the routed paths; a pad name or vN(x,y) marks a point on that pad's centre or on a via; arc(x,y) is an arc through that point)
3V3: length 94.1
  Top Layer w0.254: C10.2 10.96,38.88 R12.2 ; C9.2 45.97,27.07 44.62,28.42 37.97,28.42 36.93,27.38 36.93,26.67 R17.2
  Top Layer w0.508: v1(48.06,18.69) 45.98,18.69 C9.2 45.97,18.69 U3.5 ; v1(19.25,40.38) 19.25,40.39 16.75,40.39 16.73,40.4 C12.2 C11.2 C10.2 7.45,40.4 v1(7.41,40.44)
  Bottom Layer w0.508: v1(7.41,40.44) 7.41,40.38 4.11,37.08 4.11,29.73 BUZZER1.1 ; v1(48.06,18.69) 48.06,27.79 42.11,33.73 29.97,33.73 23.26,40.44 19.3,40.44 v1(19.25,40.38)
GND: length 8.2
  Top Layer w0.254: USBC1.A1B12 22.35,7.77 22.17,7.95 21.41,7.95 21.23,7.77 USBC1.4 ; 28.75,6.55 28.8,6.6 28.8,7.39 29.08,7.67 29.59,7.67 29.88,7.39 USBC1.1
  vias: v1(22.6,35.34) v1(22.6,33.94) v1(22.6,32.54) v1(24,35.34) v1(24,33.94) v1(24,32.54) v1(25.4,35.34) v1(25.4,33.94) v1(25.4,32.54)
VIN: length 2.4
  Top Layer w0.381: 40.33,18.35 40.33,17.74 ; 40.33,17.74 40.33,17.18 ; 40.33,17.74 40.32,17.75 39.06,17.75
Vin: length 4.9
  Top Layer w0.381: SW2.2 39.01,17.74 ; 40.33,17.18 40.74,16.78 41.86,16.78 ; U3.1 40.67,18.69 40.33,18.35
BAT+: length 14.4
  Top Layer w0.254: CN1.2 R16.1
  Top Layer w0.508: U1.5 28.61,20.52 29.11,20.03 C2.1 31.86,18.24 v3(32.21,17.89) 32.66,17.44 Q2.3
  Bottom Layer w0.508: v3(32.21,17.89) 34.22,17.89 CN1.2
BEEP: length 15.8
  Top Layer w0.254: 16.73,30.24 16.57,30.07 15.34,30.07 13.82,28.55 13.82,22.35 11.72,20.26 R6.1
BOOT: length 5.7
  Top Layer w0.508: 34.23,25.16 36.92,25.16 R17.1 39.87,25.15 H1.1
D+: length 27.1
  Top Layer w0.254: v2(15.3,25.14) 16.72,25.14 16.73,25.16 ; 25.29,6.56 25.3,6.56 25.3,7.51 25.55,7.76 v2(26.31,7.76) 26.31,6.58 26.29,6.56
  Bottom Layer w0.254: v2(15.3,25.14) 14.74,24.58 14.74,19.33 v2(26.31,7.76)
D-: length 29.9
  Top Layer w0.254: 25.79,6.56 25.81,6.55 25.81,5.35 25.68,5.22 24.92,5.22 24.79,5.34 24.79,7.75 v2(24.78,7.76) ; 16.73,26.43 15.31,26.43 v2(15.3,26.42)
  Bottom Layer w0.254: v2(15.3,26.42) 13.92,25.04 13.92,18.62 v2(24.78,7.76)
EN: length 8.9
  Top Layer w0.254: 16.73,39.13 12.83,39.13 12.47,38.77 ; 12.47,38.77 R12.1 ; 12.47,38.77 12.47,37.3 C6.2 12.42,34.46 SW1.2
IO4: length 21.8
  Top Layer w0.254: R13.1 10.78,26.36 R9.1 ; v2(15.29,37.84) 16.75,37.84 16.75,37.85
  Bottom Layer w0.254: R13.1 8.53,26.35 C3.2 8.53,33.53 12.85,37.84 v2(15.29,37.84)
IO5: length 52.2
  Top Layer w0.254: 16.73,36.59 16.72,36.57 v2(15.29,36.57) ; R10.1 v2(9.4,30.33)
  Bottom Layer w0.254: v2(15.29,36.57) 12.95,36.57 9.4,33.02 v2(9.4,30.33) 41.45,30.33 43.64,28.14 43.64,26.4 R14.1 46.02,26.35 C4.2
IO6: length 15.4
  Top Layer w0.254: C5.2 5.38,31.91 R15.1 10.76,31.91 R11.1 10.82,31.94 10.82,32.46 11.3,32.94 13.44,32.94 15.81,35.32 16.73,35.32
IO7: length 26.1
  Top Layer w0.254: v2(25.81,25.95) 17.72,34.04 16.75,34.04 ; C7.2 35.87,19.7 R19.1 35.81,21.19 R16.2 34.23,21.18 v2(30.64,21.18)
  Bottom Layer w0.254: v2(25.81,25.95) 25.85,25.95 30.62,21.18 v2(30.64,21.18)
IO15: length 8
  Top Layer w0.508: 16.73,32.78 14.69,32.78 13.82,31.9 R11.2 R10.2 R9.2
LED: length 12.4
  Top Layer w0.254: 16.73,28.97 16.67,28.9 15.39,28.9 14.55,28.06 14.55,18.25 R18.1
RXD: length 3.5
  Top Layer w0.254: 34.23,36.59 35.69,36.59 36.25,36.02 H2.1
TXD: length 3.6
  Top Layer w0.254: 34.23,37.86 35.55,37.86 36.25,38.56 H2.2
USB+: length 16.8
  Top Layer w0.508: 23.74,8.65 27.95,8.65 ; 23.74,8.65 23.74,10.3 ; 23.74,8.65 23.65,8.65 23.14,8.15 23.14,6.56 ; 27.95,8.65 29.42,10.11 R8.2 30.08,10.12 D1.1 ; 27.95,8.65 USBC1.B4A9 ; 31.71,12.19 31.71,10.12
VOUT: length 4.1
  Top Layer w0.508: 34.95,11.83 34.95,10.12
  Top Layer w0.762: 37.39,10.12 34.95,10.12
Vout: length 1.5
  Top Layer w0.508: 34.95,11.83 34.59,12.19 Q2.2
$1N1210: length 2
  Top Layer w0.254: 24.71,14.71 24.71,12.72 R1.2
$1N1215: length 19.7
  Top Layer w0.254: R5.1 R4.1 ; R4.1 21.33,20.08 21.69,20.44 23.35,20.44 U1.8 ; R4.1 22.2,18.24
  Top Layer w0.381: U1.4 27.25,12.83 ; 27.26,12.74 27.26,10.57 27.07,10.38
  Bottom Layer w0.254: v3(27.26,13.51) 27.23,13.54 27.23,16.61 25.6,18.24 v2(22.2,18.24)
$1N1216: length 14.5
  Top Layer w0.254: U1.6 25.98,21.53 25.2,22.31 17.42,22.31 16.25,21.14 LED_R1.1
$1N1217: length 10.4
  Top Layer w0.254: LED_G1.1 18.08,21.04 18.57,21.53 24.46,21.53 24.71,21.27 24.71,20.52
$1N1218: length 6.8
  Top Layer w0.254: LED_R1.2 16.26,15.96 16.56,15.66 20.98,15.66 21.33,16.02 R4.2
$1N1219: length 1.7
  Top Layer w0.254: LED_G1.2 19.71,16.69 R5.2
$1N3085: length 2.8
  Top Layer w0.254: USBC1.B5 27.3,6.55 v2(27.3,5.3)
  Bottom Layer w0.254: R7.2 27.3,3.92 v2(27.3,5.3)
$1N3089: length 2.8
  Top Layer w0.254: USBC1.A5 24.3,5.1 v2(24.31,5.09)
  Bottom Layer w0.254: v2(24.31,5.09) 24.31,3.99 R2.2
$1N3711: length 1.7
  Top Layer w0.254: LED1.2 14.53,16.67 R18.2
$1N3715: length 2.3
  Bottom Layer w0.254: BUZZER1.2 Q1.3
$1N3716: length 2
  Top Layer w0.254: v2(7.67,18.74) 8.73,18.74 R6.2
  Bottom Layer w0.254: v2(7.67,18.74) 6.76,18.74 Q1.1

## Copper pours and planes (outline as drawn; the poured copper is in the pictures)
GND on Top Layer: 50.98,25.99 50.94,26.99 50.86,27.99 50.74,28.99 50.58,29.98 50.39,30.96 50.15,31.93 49.88,32.9 49.57,33.85 49.22,34.79 48.84,35.72 48.42,36.63 47.97,37.52 47.48,38.4 46.95,39.25 46.39,40.09 45.81,40.9 45.18,41.68 44.53,42.45 43.85,43.18 43.14,43.89 42.41,44.57 41.65,45.22 40.86,45.84 40.05,46.43 39.21,46.99 38.36,47.51 37.48,48 36.59,48.46 35.68,48.88 34.75,49.26 33.81,49.61 32.86,49.92 31.9,50.19 30.92,50.43 29.94,50.62 28.95,50.78 27.95,50.9 26.95,50.97 25.95,51.01 24.95,51.01 23.95,50.97 22.95,50.9 21.95,50.78 20.96,50.62 19.98,50.43 19,50.19 18.04,49.92 17.08,49.61 16.14,49.26 15.22,48.88 14.31,48.46 13.41,48 12.54,47.51 11.68,46.99 10.85,46.43 10.04,45.84 9.25,45.22 8.49,44.57 7.75,43.89 7.04,43.18 6.36,42.45 5.71,41.68 5.09,40.9 4.5,40.09 3.95,39.25 3.42,38.4 2.93,37.52 2.48,36.63 2.06,35.72 1.67,34.79 1.33,33.85 1.02,32.9 0.75,31.93 0.51,30.96 0.32,29.98 0.16,28.99 0.04,27.99 -0.04,26.99 -0.08,25.99 -0.08,24.99 -0.04,23.98 0.04,22.99 0.16,21.99 0.32,21 0.51,20.02 0.75,19.04 1.02,18.08 1.33,17.12 1.67,16.18 2.06,15.26 2.48,14.35 2.93,13.45 3.42,12.58 3.95,11.72 4.5,10.89 5.09,10.08 5.71,9.29 6.36,8.53 7.04,7.79 7.75,7.08 8.49,6.4 9.25,5.75 10.04,5.13 10.85,4.54 11.68,3.98 12.54,3.46 13.41,2.97 14.31,2.52 15.22,2.1 16.14,1.71 17.08,1.37 18.04,1.06 19,0.78 19.98,0.55 20.96,0.35 21.95,0.2 22.95,0.08 23.95,0 24.95,-0.04 25.95,-0.04 26.95,0 27.95,0.08 28.95,0.2 29.94,0.35 30.92,0.55 31.9,0.78 32.86,1.06 33.81,1.37 34.75,1.71 35.68,2.1 36.59,2.52 37.48,2.97 38.36,3.46 39.21,3.98 40.05,4.54 40.86,5.13 41.65,5.75 42.41,6.4 43.14,7.08 43.85,7.79 44.53,8.53 45.18,9.29 45.81,10.08 46.39,10.89 46.95,11.72 47.48,12.58 47.97,13.45 48.42,14.35 48.84,15.26 49.22,16.18 49.57,17.12 49.88,18.08 50.15,19.04 50.39,20.02 50.58,21 50.74,21.99 50.86,22.99 50.94,23.98 50.98,24.99
GND on Bottom Layer: 50.76,26.01 50.72,27 50.64,27.99 50.53,28.98 50.37,29.96 50.18,30.94 49.95,31.9 49.68,32.86 49.37,33.8 49.02,34.74 48.64,35.66 48.23,36.56 47.78,37.44 47.29,38.31 46.77,39.16 46.22,39.99 45.63,40.79 45.02,41.57 44.37,42.33 43.7,43.06 43,43.76 42.27,44.43 41.51,45.08 40.73,45.69 39.92,46.28 39.1,46.83 38.25,47.35 37.38,47.84 36.5,48.29 35.59,48.7 34.68,49.08 33.74,49.43 32.8,49.74 31.84,50.01 30.87,50.24 29.9,50.43 28.92,50.59 27.93,50.7 26.94,50.78 25.95,50.82 24.95,50.82 23.96,50.78 22.97,50.7 21.98,50.59 21,50.43 20.02,50.24 19.06,50.01 18.1,49.74 17.15,49.43 16.22,49.08 15.3,48.7 14.4,48.29 13.51,47.84 12.65,47.35 11.8,46.83 10.97,46.28 10.17,45.69 9.39,45.08 8.63,44.43 7.9,43.76 7.2,43.06 6.52,42.33 5.88,41.57 5.26,40.79 4.68,39.99 4.13,39.16 3.61,38.31 3.12,37.44 2.67,36.56 2.25,35.66 1.87,34.74 1.53,33.8 1.22,32.86 0.95,31.9 0.72,30.94 0.53,29.96 0.37,28.98 0.25,27.99 0.18,27 0.14,26.01 0.14,25.01 0.18,24.02 0.25,23.03 0.37,22.04 0.53,21.06 0.72,20.08 0.95,19.12 1.22,18.16 1.53,17.22 1.87,16.28 2.25,15.36 2.67,14.46 3.12,13.58 3.61,12.71 4.13,11.86 4.68,11.03 5.26,10.23 5.88,9.45 6.52,8.69 7.2,7.96 7.9,7.26 8.63,6.59 9.39,5.94 10.17,5.32 10.97,4.74 11.8,4.19 12.65,3.67 13.51,3.18 14.4,2.73 15.3,2.31 16.22,1.93 17.15,1.59 18.1,1.28 19.06,1.01 20.02,0.78 21,0.59 21.98,0.43 22.97,0.31 23.96,0.24 24.95,0.2 25.95,0.2 26.94,0.24 27.93,0.31 28.92,0.43 29.9,0.59 30.87,0.78 31.84,1.01 32.8,1.28 33.74,1.59 34.68,1.93 35.59,2.31 36.5,2.73 37.38,3.18 38.25,3.67 39.1,4.19 39.92,4.74 40.73,5.32 41.51,5.94 42.27,6.59 43,7.26 43.7,7.96 44.37,8.69 45.02,9.45 45.63,10.23 46.22,11.03 46.77,11.86 47.29,12.71 47.78,13.58 48.23,14.46 48.64,15.36 49.02,16.28 49.37,17.22 49.68,18.16 49.95,19.12 50.18,20.08 50.37,21.06 50.53,22.04 50.64,23.03 50.72,24.02 50.76,25.01
